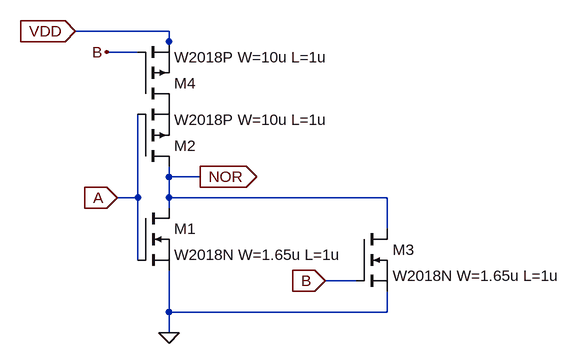
[diagram p0: schematic NOR.asc]
NOR.asc, the LTspice schematic file:
Version 4
SHEET 1 880 680
WIRE 256 16 112 16
WIRE 256 32 256 16
WIRE 208 48 160 48
WIRE 256 48 256 32
WIRE 256 240 256 224
WIRE 304 240 256 240
WIRE 208 272 208 144
WIRE 208 272 176 272
WIRE 256 272 256 240
WIRE 592 272 256 272
WIRE 256 288 256 272
WIRE 592 320 592 272
WIRE 208 368 208 272
WIRE 544 400 496 400
WIRE 256 448 256 384
WIRE 592 448 592 416
WIRE 592 448 256 448
WIRE 256 480 256 448
FLAG 256 480 0
FLAG 112 16 VDD
IOPIN 112 16 In
FLAG 176 272 A
IOPIN 176 272 In
FLAG 304 240 NOR
IOPIN 304 240 Out
FLAG 160 48 B
FLAG 496 400 B
IOPIN 496 400 In
SYMBOL nmos 208 288 R0
SYMATTR InstName M1
SYMATTR Value W2018N W=1.65u L=1u
SYMBOL pmos 208 224 M180
SYMATTR InstName M2
SYMATTR Value W2018P W=10u L=1u
SYMBOL nmos 544 320 R0
SYMATTR InstName M3
SYMATTR Value W2018N W=1.65u L=1u
SYMBOL pmos 208 128 M180
SYMATTR InstName M4
SYMATTR Value W2018P W=10u L=1u

The netlist it stands for:
* NOR.asc
M1 NOR A 0 0 W2018N W=1.65u L=1u
M2 NOR A P001 P001 W2018P W=10u L=1u
M3 NOR B 0 0 W2018N W=1.65u L=1u
M4 P001 B VDD VDD W2018P W=10u L=1u
.model NMOS NMOS
.model PMOS PMOS
.lib standard.mos
.backanno
.end